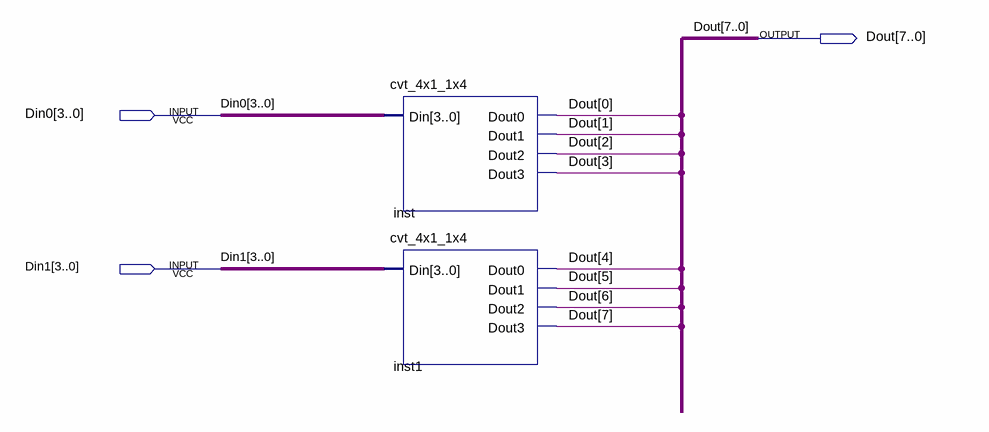
[diagram p0: schematic sheet]
// Quartus schematic cvt_4x2_8x1.bdf as structural Verilog: 2 symbols, 3 pins
module cvt_4x2_8x1 (
  input  [3:0] Din0,
  input  [3:0] Din1,
  output [7:0] Dout
);

  cvt_4x1_1x4 inst (.Din(Din0), .Dout0(Dout[0]), .Dout1(Dout[1]), .Dout2(Dout[2]), .Dout3(Dout[3]));
  cvt_4x1_1x4 inst1 (.Din(Din1), .Dout0(Dout[4]), .Dout1(Dout[5]), .Dout2(Dout[6]), .Dout3(Dout[7]));
endmodule
